# Altium schematic sheet DB42_Hardware_Kit.SchDoc: DB42 Hardware Kit
size A4; Organization: Altium Limited.; Address1: Level 3, 12a Rodborough Rd; Address2: Frenchs Forest 2086; Address3: NSW; Address4: AUSTRALIA; DocumentNumber: 9; SheetNumber: 9; SheetTotal: 23
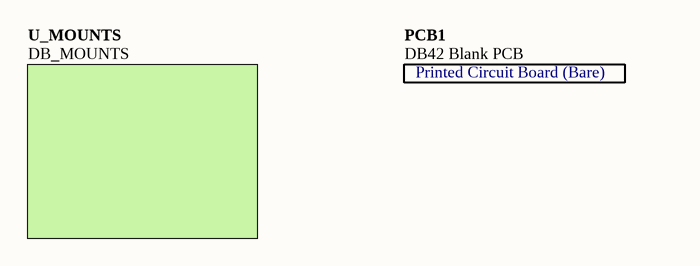
[diagram p0: DB42_Hardware_Kit.SchDoc]

## Parts
PCB1  DB42 Blank PCB  [DB42 Blank PCB]

## Sub-sheets
U_MOUNTS = DB_MOUNTS: no entries

## Notes on the sheet
- Sheet Title
- Project Title
- Size:
- Date:
- A4
- Assy:
- Time:
- Revision:
- Sheet
- of
- File:
- (in symbol D-810-0025) Printed Circuit Board (Bare)

## Library data of the parts
PCB1 = D-810-0025: DB42 Blank PCB - Daughter Board; ProjectPath: DB42.PrjPCB; Status: Unreleased; Category: Blank PCB